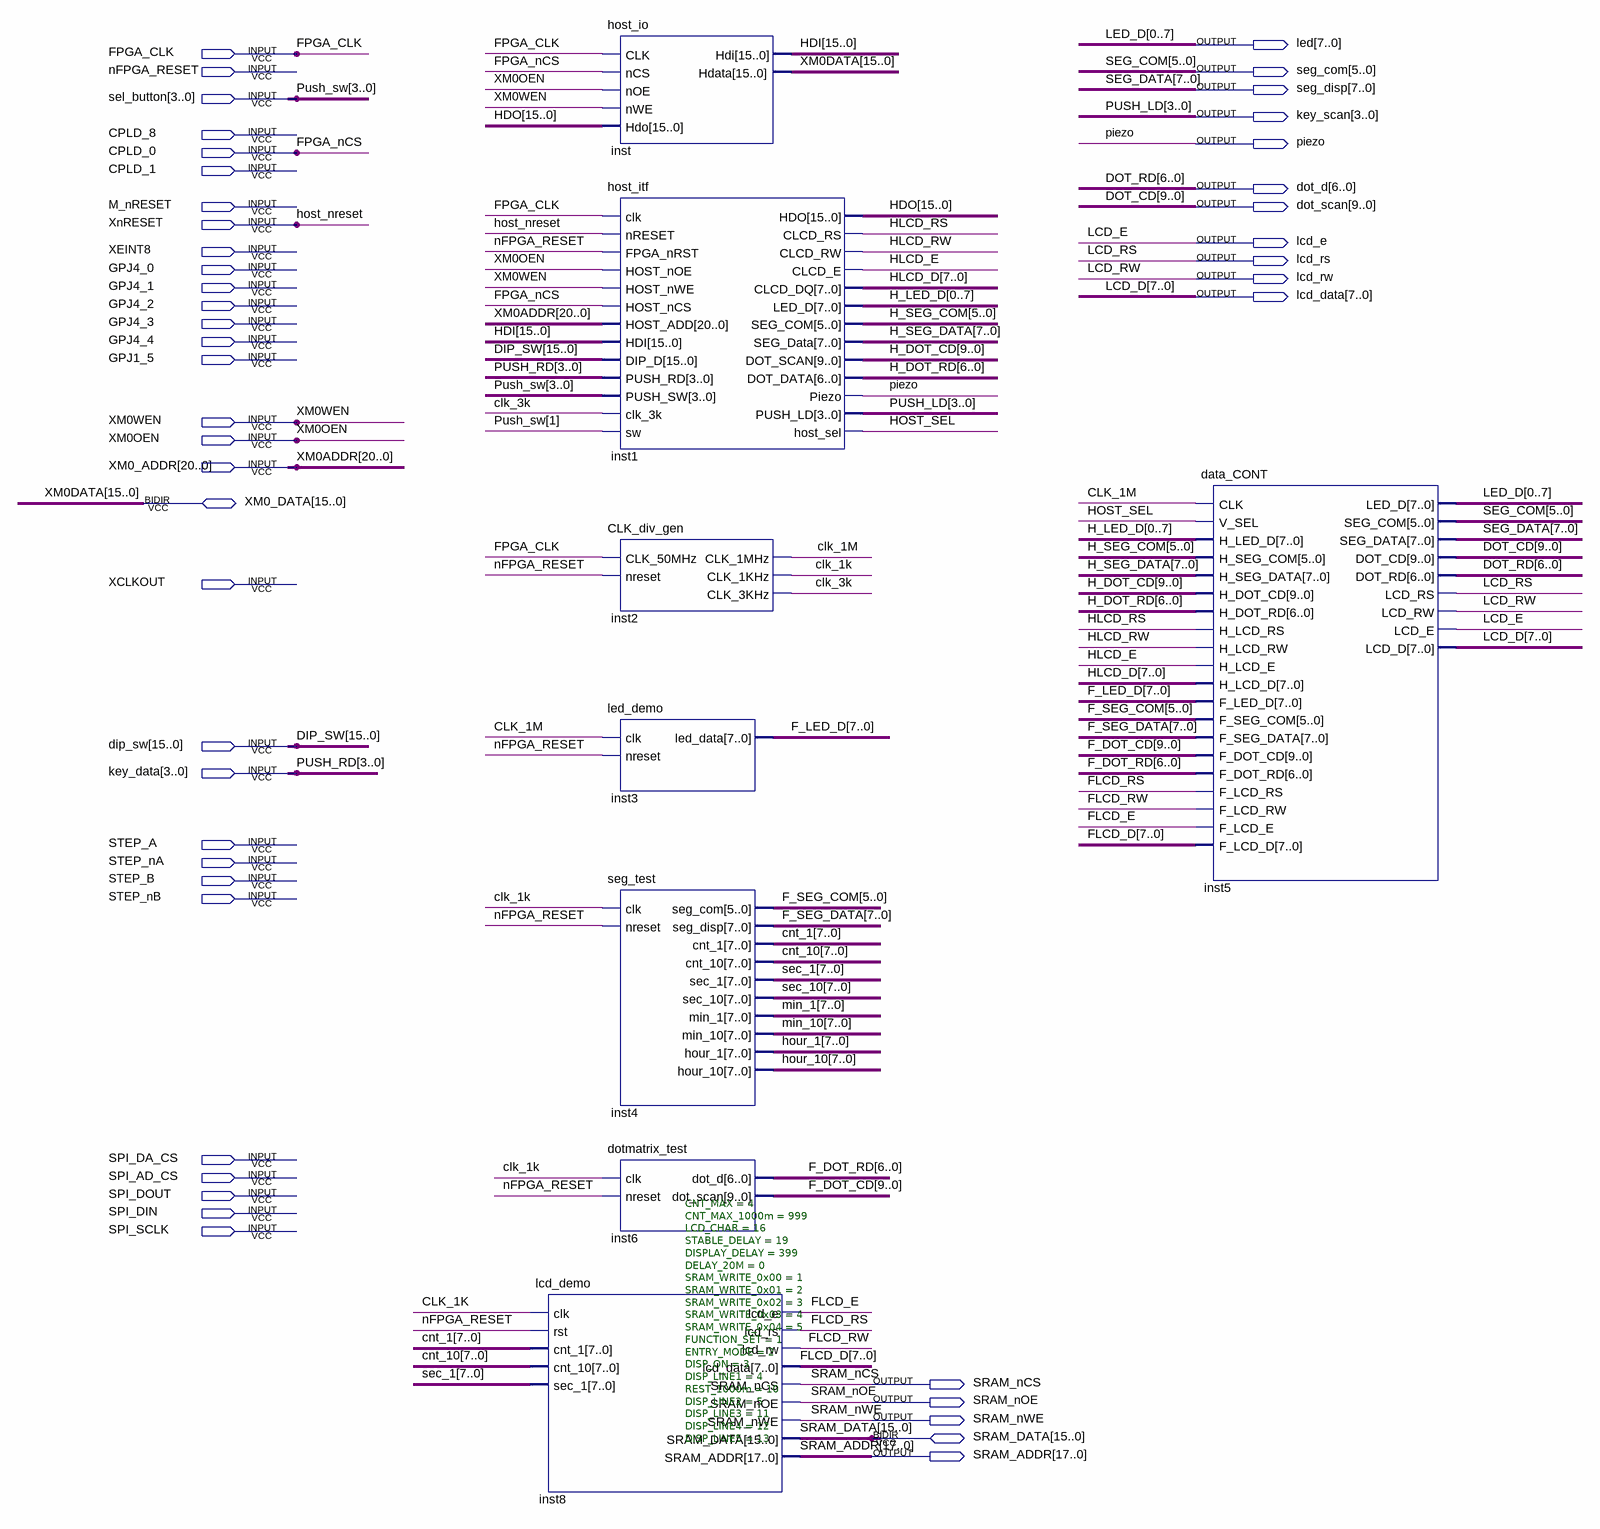
[diagram p0: schematic sheet]
// Quartus schematic M3.bdf as structural Verilog: 8 symbols, 47 pins
module M3 (
  input  FPGA_CLK,
  input  nFPGA_RESET,
  input  [3:0] sel_button,
  input  CPLD_8,
  input  CPLD_0,
  input  CPLD_1,
  input  M_nRESET,
  input  XnRESET,
  input  XEINT8,
  input  GPJ4_0,
  input  GPJ4_1,
  input  GPJ4_2,
  input  GPJ4_3,
  input  GPJ4_4,
  input  GPJ1_5,
  input  XM0WEN,
  input  XM0OEN,
  input  [20:0] XM0_ADDR,
  input  XCLKOUT,
  input  [15:0] dip_sw,
  input  [3:0] key_data,
  input  STEP_A,
  input  STEP_nA,
  input  STEP_B,
  input  STEP_nB,
  input  SPI_DA_CS,
  input  SPI_AD_CS,
  input  SPI_DOUT,
  input  SPI_DIN,
  input  SPI_SCLK,
  inout  [15:0] XM0_DATA,
  inout  [15:0] SRAM_DATA,
  output [7:0] led,
  output [5:0] seg_com,
  output [7:0] seg_disp,
  output [3:0] key_scan,
  output piezo,
  output [6:0] dot_d,
  output [9:0] dot_scan,
  output lcd_e,
  output lcd_rs,
  output lcd_rw,
  output [7:0] lcd_data,
  output SRAM_nCS,
  output SRAM_nOE,
  output SRAM_nWE,
  output [17:0] SRAM_ADDR
);

  wire clk_1k, clk_1M, clk_3k, FLCD_E, FLCD_RS, FLCD_RW, HLCD_E, HLCD_RS, HLCD_RW, HOST_SEL;
  wire [5:0] F_SEG_COM, H_SEG_COM;
  wire [6:0] F_DOT_RD, H_DOT_RD;
  wire [7:0] cnt_1, cnt_10, F_LED_D, F_SEG_DATA, FLCD_D, H_LED_D, H_SEG_DATA, HLCD_D, hour_1, hour_10, min_1,
       min_10, sec_1, sec_10;
  wire [9:0] F_DOT_CD, H_DOT_CD;
  wire [15:0] HDI, HDO;

  lcd_demo #(.CNT_MAX(4), .CNT_MAX_1000m(999), .LCD_CHAR(16), .STABLE_DELAY(19), .DISPLAY_DELAY(399), .DELAY_20M(0), .SRAM_WRITE_0x00(1), .SRAM_WRITE_0x01(2), .SRAM_WRITE_0x02(3), .SRAM_WRITE_0x03(4), .SRAM_WRITE_0x04(5), .FUNCTION_SET(1), .ENTRY_MODE(2), .DISP_ON(3), .DISP_LINE1(4), .REST_1000m(10), .DISP_LINE2(5), .DISP_LINE3(11), .DISP_LINE4(12), .DISP_LINE5(13)) inst8 (
    .clk(clk_1k), .rst(nFPGA_RESET), .cnt_1(cnt_1), .cnt_10(cnt_10), .sec_1(sec_1), .lcd_e(FLCD_E),
    .lcd_rs(FLCD_RS), .lcd_rw(FLCD_RW), .lcd_data(FLCD_D), .SRAM_nCS(SRAM_nCS), .SRAM_nOE(SRAM_nOE),
    .SRAM_nWE(SRAM_nWE), .SRAM_ADDR(SRAM_ADDR), .SRAM_DATA(SRAM_DATA));
  host_io inst (.CLK(FPGA_CLK), .nCS(CPLD_0), .nOE(XM0OEN), .nWE(XM0WEN), .Hdo(HDO), .Hdi(HDI), .Hdata(XM0_DATA));
  host_itf inst1 (
    .clk(FPGA_CLK), .nRESET(XnRESET), .FPGA_nRST(nFPGA_RESET), .HOST_nOE(XM0OEN), .HOST_nWE(XM0WEN),
    .HOST_nCS(CPLD_0), .HOST_ADD(XM0_ADDR), .HDI(HDI), .DIP_D(dip_sw), .PUSH_RD(key_data),
    .PUSH_SW(sel_button), .clk_3k(clk_3k), .sw(sel_button[1]), .HDO(HDO), .CLCD_RS(HLCD_RS),
    .CLCD_RW(HLCD_RW), .CLCD_E(HLCD_E), .CLCD_DQ(HLCD_D),
    .LED_D({H_LED_D[0], H_LED_D[1], H_LED_D[2], H_LED_D[3], H_LED_D[4], H_LED_D[5], H_LED_D[6], H_LED_D[7]}),
    .SEG_COM(H_SEG_COM), .SEG_Data(H_SEG_DATA), .DOT_SCAN(H_DOT_CD), .DOT_DATA(H_DOT_RD), .Piezo(piezo),
    .PUSH_LD(key_scan), .host_sel(HOST_SEL));
  CLK_div_gen inst2 (
    .CLK_50MHz(FPGA_CLK), .nreset(nFPGA_RESET), .CLK_1MHz(clk_1M), .CLK_1KHz(clk_1k), .CLK_3KHz(clk_3k));
  led_demo inst3 (.clk(clk_1M), .nreset(nFPGA_RESET), .led_data(F_LED_D));
  seg_test inst4 (
    .clk(clk_1k), .nreset(nFPGA_RESET), .seg_com(F_SEG_COM), .seg_disp(F_SEG_DATA), .cnt_1(cnt_1),
    .cnt_10(cnt_10), .sec_1(sec_1), .sec_10(sec_10), .min_1(min_1), .min_10(min_10), .hour_1(hour_1),
    .hour_10(hour_10));
  dotmatrix_test inst6 (.clk(clk_1k), .nreset(nFPGA_RESET), .dot_d(F_DOT_RD), .dot_scan(F_DOT_CD));
  data_CONT inst5 (
    .CLK(clk_1M), .V_SEL(HOST_SEL),
    .H_LED_D({H_LED_D[0], H_LED_D[1], H_LED_D[2], H_LED_D[3], H_LED_D[4], H_LED_D[5], H_LED_D[6], H_LED_D[7]}),
    .H_SEG_COM(H_SEG_COM), .H_SEG_DATA(H_SEG_DATA), .H_DOT_CD(H_DOT_CD), .H_DOT_RD(H_DOT_RD),
    .H_LCD_RS(HLCD_RS), .H_LCD_RW(HLCD_RW), .H_LCD_E(HLCD_E), .H_LCD_D(HLCD_D), .F_LED_D(F_LED_D),
    .F_SEG_COM(F_SEG_COM), .F_SEG_DATA(F_SEG_DATA), .F_DOT_CD(F_DOT_CD), .F_DOT_RD(F_DOT_RD),
    .F_LCD_RS(FLCD_RS), .F_LCD_RW(FLCD_RW), .F_LCD_E(FLCD_E), .F_LCD_D(FLCD_D), .LED_D(led),
    .SEG_COM(seg_com), .SEG_DATA(seg_disp), .DOT_CD(dot_scan), .DOT_RD(dot_d), .LCD_RS(lcd_rs),
    .LCD_RW(lcd_rw), .LCD_E(lcd_e), .LCD_D(lcd_data));

  // Other names for the same wires on the sheet: FPGA_nCS = CPLD_0; DOT_CD[9:0] = dot_scan; DOT_RD[6:0] = dot_d;
  //   PUSH_RD[3:0] = key_data; LCD_D[7:0] = lcd_data;
  //   LED_D[7:0] = {led[0], led[1], led[2], led[3], led[4], led[5], led[6], led[7]}; PUSH_LD[3:0] = key_scan;
  //   SEG_DATA[7:0] = seg_disp; Push_sw[3:0] = sel_button; XM0ADDR[20:0] = XM0_ADDR; XM0DATA[15:0] = XM0_DATA;
  //   host_nreset = XnRESET
endmodule
